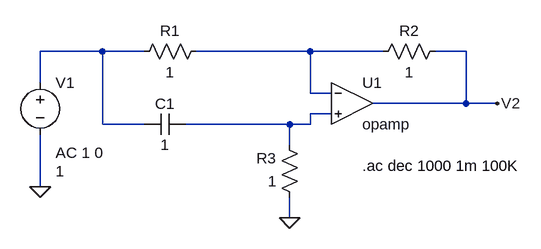
[diagram p0: schematic TS0.asc]
TS0.asc, the LTspice schematic file:
Version 4
SHEET 1 880 680
WIRE -128 64 -224 64
WIRE -64 64 -128 64
WIRE 192 64 16 64
WIRE 304 64 192 64
WIRE 432 64 384 64
WIRE -224 112 -224 64
WIRE 192 128 192 64
WIRE 224 128 192 128
WIRE 432 144 432 64
WIRE 432 144 288 144
WIRE 480 144 432 144
WIRE 224 160 192 160
WIRE -128 176 -128 64
WIRE -64 176 -128 176
WIRE 160 176 0 176
WIRE 192 176 192 160
WIRE 192 176 160 176
WIRE 160 208 160 176
WIRE -224 272 -224 192
WIRE 160 320 160 288
FLAG 160 320 0
FLAG 480 144 V2
FLAG -224 272 0
SYMBOL opamp 256 80 R0
SYMATTR InstName U1
SYMBOL res 32 48 R90
WINDOW 0 0 56 VBottom 2
WINDOW 3 32 56 VTop 2
SYMATTR InstName R1
SYMATTR Value 1
SYMBOL res 400 48 R90
WINDOW 0 0 56 VBottom 2
WINDOW 3 32 56 VTop 2
SYMATTR InstName R2
SYMATTR Value 1
SYMBOL res 176 304 R180
WINDOW 0 36 76 Left 2
WINDOW 3 36 40 Left 2
SYMATTR InstName R3
SYMATTR Value 1
SYMBOL cap 0 160 R90
WINDOW 0 0 32 VBottom 2
WINDOW 3 32 32 VTop 2
SYMATTR InstName C1
SYMATTR Value 1
SYMBOL voltage -224 96 R0
WINDOW 3 24 152 Left 2
WINDOW 123 24 124 Left 2
WINDOW 39 0 0 Left 0
SYMATTR Value 1
SYMATTR Value2 AC 1 0
SYMATTR InstName V1
TEXT 272 240 Left 2 !.ac dec 1000 1m 100K

The netlist it stands for:
* TS0.asc
XU1 N002 N003 V2 opamp Aol=100K GBW=10Meg  ; pins invin noninvin out
R1 N002 N001 1
R2 V2 N002 1
R3 0 N003 1
C1 N003 N001 1
V1 N001 0 1 AC 1 0
.ac dec 1000 1m 100K
.backanno
.end